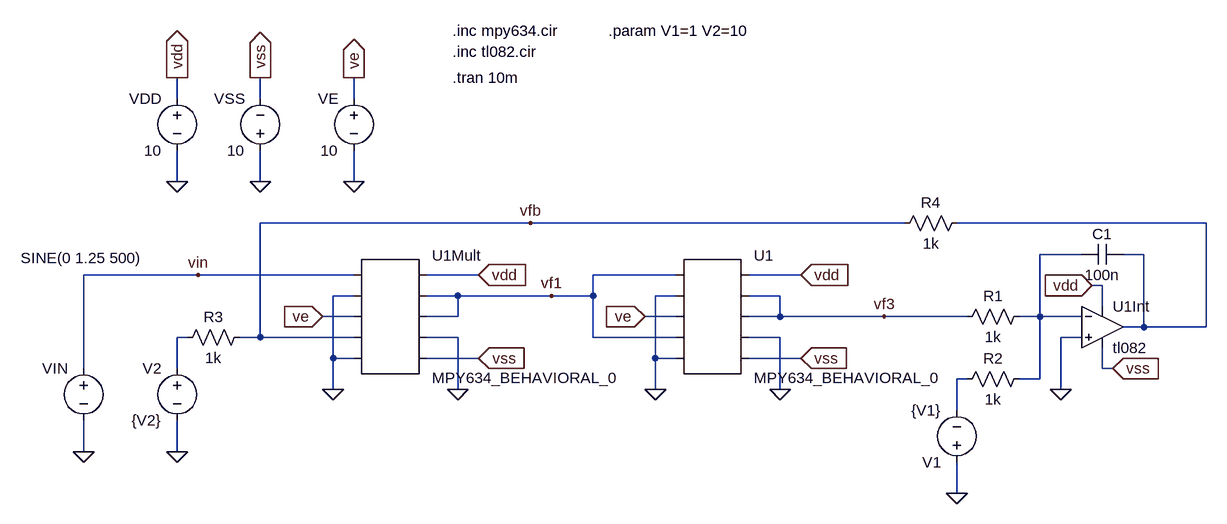
[diagram p0: schematic AGC.asc]
AGC.asc, the LTspice schematic file:
Version 4
SHEET 1 1236 680
WIRE -368 -176 -368 -208
WIRE -240 -176 -240 -208
WIRE -96 -176 -96 -208
WIRE -368 -48 -368 -96
WIRE -240 -48 -240 -96
WIRE -96 -48 -96 -96
WIRE 176 16 -240 16
WIRE 752 16 176 16
WIRE 1216 16 832 16
WIRE 1024 64 960 64
WIRE 1120 64 1088 64
WIRE -336 96 -512 96
WIRE -96 96 -336 96
WIRE 96 96 16 96
WIRE 400 96 272 96
WIRE 592 96 512 96
WIRE 1056 112 1040 112
WIRE -96 128 -128 128
WIRE 64 128 16 128
WIRE 208 128 64 128
WIRE 272 128 272 96
WIRE 272 128 208 128
WIRE 400 128 368 128
WIRE 560 128 512 128
WIRE 1056 144 1056 112
WIRE -96 160 -144 160
WIRE 64 160 64 128
WIRE 64 160 16 160
WIRE 400 160 352 160
WIRE 560 160 560 128
WIRE 560 160 512 160
WIRE 720 160 560 160
WIRE 848 160 720 160
WIRE 960 160 960 64
WIRE 960 160 928 160
WIRE 1024 160 960 160
WIRE 1120 176 1120 64
WIRE 1120 176 1088 176
WIRE 1216 176 1216 16
WIRE 1216 176 1120 176
WIRE -352 192 -368 192
WIRE -240 192 -240 16
WIRE -240 192 -272 192
WIRE -96 192 -240 192
WIRE 64 192 16 192
WIRE 272 192 272 128
WIRE 400 192 272 192
WIRE 560 192 512 192
WIRE 1024 192 992 192
WIRE -128 224 -128 128
WIRE -96 224 -128 224
WIRE 96 224 16 224
WIRE 368 224 368 128
WIRE 400 224 368 224
WIRE 592 224 512 224
WIRE -512 240 -512 96
WIRE -368 240 -368 192
WIRE 1056 240 1056 208
WIRE 1072 240 1056 240
WIRE 848 256 832 256
WIRE 960 256 960 160
WIRE 960 256 928 256
WIRE -128 272 -128 224
WIRE 64 272 64 192
WIRE 368 272 368 224
WIRE 560 272 560 192
WIRE 992 272 992 192
WIRE 832 304 832 256
WIRE -512 368 -512 320
WIRE -368 368 -368 320
WIRE 832 432 832 384
FLAG -368 -48 0
FLAG -240 -48 0
FLAG 992 272 0
FLAG -96 -48 0
FLAG 64 272 0
FLAG -128 272 0
FLAG -144 160 ve
IOPIN -144 160 In
FLAG 96 96 vdd
IOPIN 96 96 In
FLAG 96 224 vss
IOPIN 96 224 In
FLAG 1040 112 vdd
IOPIN 1040 112 In
FLAG 1072 240 vss
IOPIN 1072 240 In
FLAG -368 -208 vdd
IOPIN -368 -208 Out
FLAG -240 -208 vss
IOPIN -240 -208 Out
FLAG -96 -208 ve
IOPIN -96 -208 Out
FLAG -368 368 0
FLAG 560 272 0
FLAG 368 272 0
FLAG 352 160 ve
IOPIN 352 160 In
FLAG 592 96 vdd
IOPIN 592 96 In
FLAG 592 224 vss
IOPIN 592 224 In
FLAG -512 368 0
FLAG 832 432 0
FLAG -336 96 vin
FLAG 208 128 vf1
FLAG 720 160 vf3
FLAG 176 16 vfb
SYMBOL res 944 144 R90
WINDOW 0 0 56 VBottom 2
WINDOW 3 32 56 VTop 2
SYMATTR InstName R1
SYMATTR Value 1k
SYMBOL voltage -512 224 M0
WINDOW 3 -90 -154 Left 2
WINDOW 123 0 0 Left 0
WINDOW 39 0 0 Left 0
SYMATTR Value SINE(0 1.25 500)
SYMATTR InstName VIN
SYMBOL voltage -368 -192 M0
SYMATTR InstName VDD
SYMATTR Value 10
SYMBOL voltage -240 -80 R180
WINDOW 0 24 96 Left 2
WINDOW 3 24 16 Left 2
SYMATTR InstName VSS
SYMATTR Value 10
SYMBOL Opamps\\opamp2 1056 112 R0
SYMATTR InstName U1Int
SYMATTR Value tl082
SYMBOL cap 1088 48 R90
WINDOW 0 0 32 VBottom 2
WINDOW 3 32 32 VTop 2
SYMATTR InstName C1
SYMATTR Value 100n
SYMBOL AutoGenerated\\MPY634_BEHAVIORAL_0 -48 160 R0
SYMATTR InstName U1Mult
SYMBOL voltage -96 -192 M0
SYMATTR InstName VE
SYMATTR Value 10
SYMBOL voltage -368 224 M0
WINDOW 123 0 0 Left 0
WINDOW 39 0 0 Left 0
SYMATTR InstName V2
SYMATTR Value {V2}
SYMBOL AutoGenerated\\MPY634_BEHAVIORAL_0 448 160 R0
SYMATTR InstName U1
SYMBOL res 944 240 R90
WINDOW 0 0 56 VBottom 2
WINDOW 3 32 56 VTop 2
SYMATTR InstName R2
SYMATTR Value 1k
SYMBOL res -256 176 R90
WINDOW 0 0 56 VBottom 2
WINDOW 3 32 56 VTop 2
SYMATTR InstName R3
SYMATTR Value 1k
SYMBOL voltage 832 400 R180
WINDOW 123 0 0 Left 0
WINDOW 39 0 0 Left 0
SYMATTR InstName V1
SYMATTR Value {V1}
SYMBOL res 848 0 R90
WINDOW 0 0 56 VBottom 2
WINDOW 3 32 56 VTop 2
SYMATTR InstName R4
SYMATTR Value 1k
TEXT 56 -248 Left 2 !.inc tl082.cir
TEXT 56 -208 Left 2 !.tran 10m
TEXT 56 -280 Left 2 !.inc mpy634.cir
TEXT 296 -280 Left 2 !.param V1=1 V2=10

The netlist it stands for:
* AGC.asc
R1 N002 vf3 1k
VIN vin 0 SINE(0 1.25 500)
VDD vdd 0 10
VSS 0 vss 10
XU1Int 0 N002 vdd vss N001 tl082  ; pins In+ In- V+ V- OUT
C1 N001 N002 100n
* U1Mult: MPY634_BEHAVIORAL_0 (symbol AutoGenerated\MPY634_BEHAVIORAL_0 not available, pins judged from their places): pin1=vin pin2=0 pin3=ve pin4=vfb pin5=0 pin6=vdd pin7=vf1 pin8=vf1 pin9=0 pin10=vss
VE ve 0 10
V2 N003 0 {V2}
* U1: MPY634_BEHAVIORAL_0 (symbol AutoGenerated\MPY634_BEHAVIORAL_0 not available, pins judged from their places): pin1=vf1 pin2=0 pin3=ve pin4=vf1 pin5=0 pin6=vdd pin7=vf3 pin8=vf3 pin9=0 pin10=vss
R2 N002 N004 1k
R3 vfb N003 1k
V1 0 N004 {V1}
R4 N001 vfb 1k
.inc tl082.cir
.tran 10m
.inc mpy634.cir
.param V1=1 V2=10
.backanno
.end